# Altium schematic sheet BTL-Sch.SchDoc
size A3; SheetNumber: 1; SheetTotal: 2
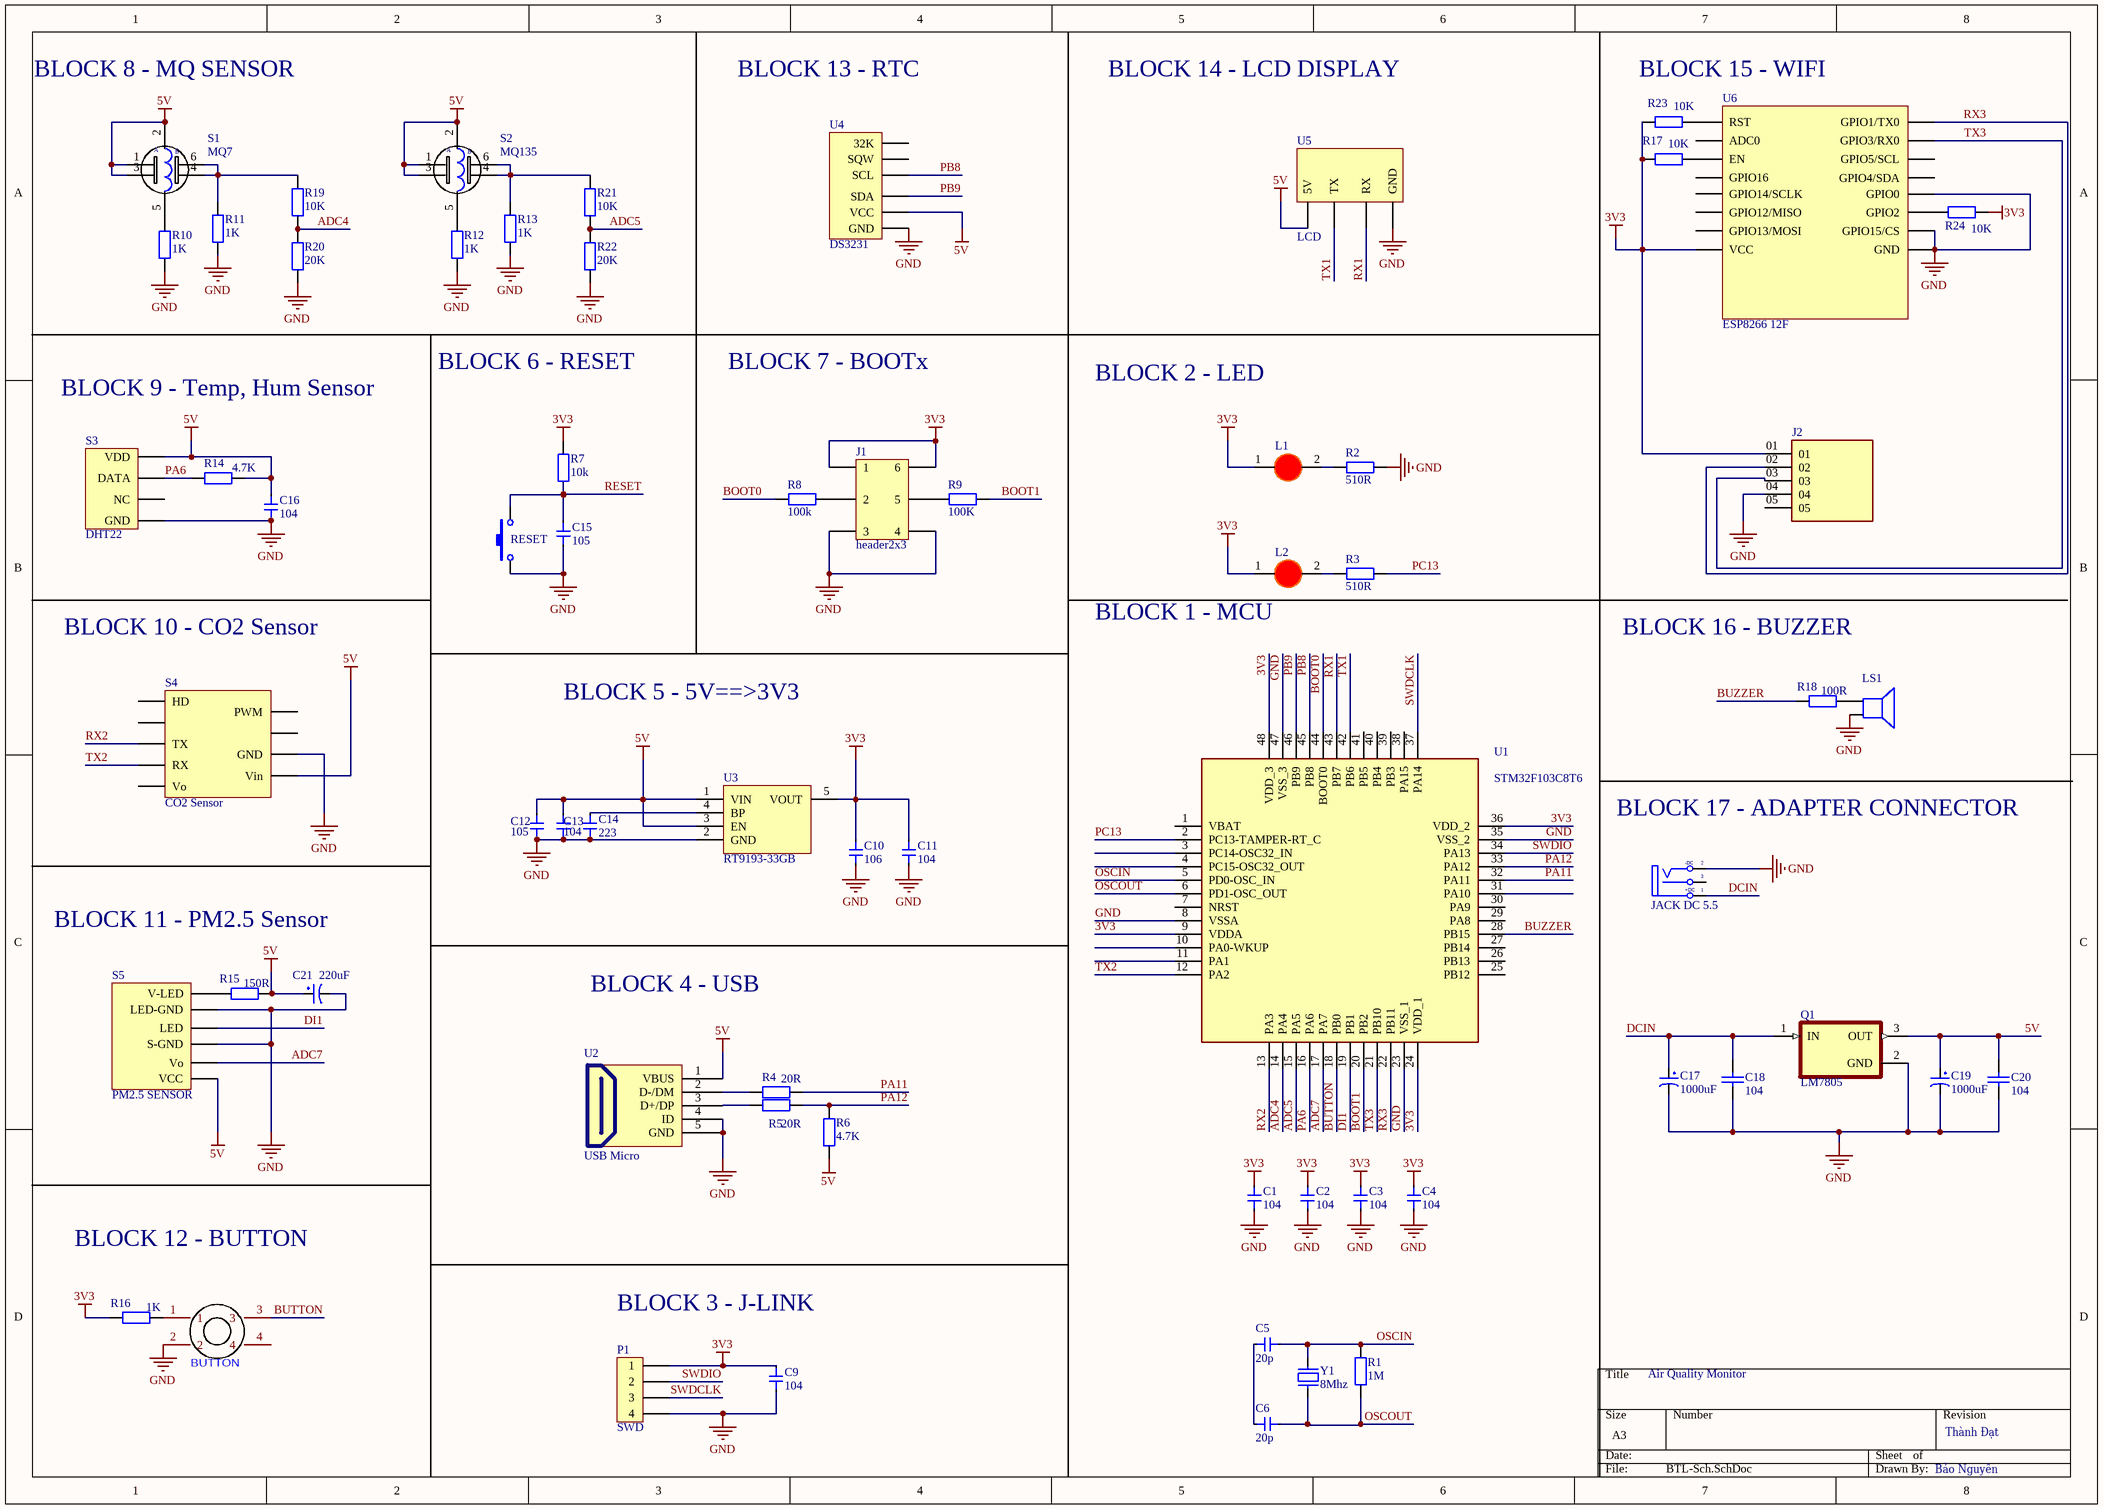
[diagram p0: BTL-Sch.SchDoc]

## Parts
BUTTON  Nut Nhan 4 chan 12x12  [12X12 BUTTOM Blue]  (value not drawn)
C1  104  [Cap 0603]
C2  104  [Cap 0603]
C3  104  [Cap 0603]
C4  104  [Cap 0603]
C5  20p  [Cap 0603]
C6  20p  [Cap 0603]
C9  104  [Cap 0603]
C10  106  [Cap 0805]
C11  104  [Cap 0805]
C12  105  [Cap 0805]
C13  104  [Cap 0603]
C14  223  [Cap 0603]
C15  105  [Cap 0603]
C16  104  [Cap 0603]
C17  1000uF  [tu hoa 8mm]
C18  104  [tu gom]
C19  1000uF  [tu hoa 8mm]
C20  104  [tu gom]
C21  220uF  [tu hoa 5mm]
J1  header2x3  [header2x3]
J2  MTSW-105-24-G-S-255  [SAMTEC_MTSW-105-24-G-S-255]  (value not drawn)
JACK_DC  JACK DC 5.5  [JACK DC 5.5]
L1  LED 0805  [LED-0805-Red]  (value not drawn)
L2  LED 0805  [LED-0805-Red]  (value not drawn)
LS1  Coi Chip Speaker  [Coi Chip Speacker]  (value not drawn)
P1  SWD  [header4p_90]
Q1  LM7805  [TO254P1054X470X2600-3]
R1  1M  [tro smd 0603]
R2  510R  [tro smd 0603]
R3  510R  [tro smd 0603]
R4  20R  [tro smd 0603]
R5  20R  [tro smd 0603]
R6  4.7K  [tro smd 0603]
R7  10k  [tro smd 0603]
R8  100k  [tro smd 0603]
R9  100K  [tro smd 0603]
R10  1K  [tro smd 0603]
R11  1K  [tro smd 0603]
R12  1K  [tro smd 0603]
R13  1K  [tro smd 0603]
R14  4.7K  [tro smd 0603]
R15  150R  [tro smd 0603]
R16  1K  [tro smd 0603]
R17  10K  [tro smd 0603]
R18  100R  [tro smd 0603]
R19  10K  [tro smd 0603]
R20  20K  [tro smd 0603]
R21  10K  [tro smd 0603]
R22  20K  [tro smd 0603]
R23  10K  [tro smd 0603]
R24  10K  [tro smd 0603]
RESET  Nut Nhan 2 Chan SMD 3x6x2.5  [Nut Nhan 2 Chan SMD 3x6x2.5]  (value not drawn)
S1  MQ7  [mq7]
S2  MQ135  [mq135]
S3  DHT22  [dht22]
S4  CO2 Sensor  [co2sensor]
S5  PM2.5 SENSOR  [pm25sensor]
U1  STM32F103C8T6  [LQFP-48_19.6_393_58X11_SMD]
U2  USB Micro  [USB Micro 5p SMD]
U3  RT9193-33GB  [SOT23-5]
U4  DS3231  [DS3231]
U5  LCD  [LCD]
U6  ESP8266 12F  [ESP826612F]
Y1  8Mhz  [Thach Anh 2 chan SMD]

## Nets
3V3: C1.1 C2.1 C3.1 C4.1 C9.1 C10.1 C11.1 J1.1 J1.6 J2.01 L1.1(A) L2.1(A) P1.1 R7.1 R16.1 R17.1 R23.1 R24.2 U1.9(VDDA) U1.24(VDD_1) U1.36(VDD_2) U1.48(VDD_3) U3.5(VOUT) U6.8(VCC)
5V: C12.1 C13.1 C16.1 C19.1 C20.1 C21.1 Q1.3(OUT) R6.1 R14.2 R15.2 S1.1 S1.2 S1.3 S2.1 S2.2 S2.3 S3.1(VDD) S4.9(Vin) S5.6(VCC) U2.1(VBUS) U3.1(VIN) U3.3(EN) U4.5(VCC) U5.1(5V)
GND: BUTTON.2 C1.2 C2.2 C3.2 C4.2 C9.2 C10.2 C11.2 C12.2 C13.2 C14.2 C15.2 C16.2 C17.2 C18.2 C19.2 C20.2 C21.2 J1.3 J1.4 J2.04 JACK_DC.2(TN) LS1.2 P1.4 Q1.2(GND) R2.2 R10.1 R11.2 R12.1 R13.2 R20.1 R22.1 RESET.1 S3.4(GND) S4.8(GND) S5.2(LED-GND) S5.4(S-GND) U1.8(VSSA) U1.23(VSS_1) U1.35(VSS_2) U1.47(VSS_3) U2.4(ID) U2.5(GND) U3.2(GND) U4.6(GND) U5.4(GND) U6.15(GND) U6.16(GPIO15/CS) U6.18(GPIO0)
ADC4: R19.1 R20.2 U1.14(PA4)
ADC5: R21.1 R22.2 U1.15(PA5)
ADC7: S5.5(Vo) U1.17(PA7)
BOOT0: R8.2 U1.44(BOOT0)
BOOT1: R9.1 U1.20(PB2)
BUTTON: BUTTON.3 U1.18(PB0)
BUZZER: R18.1 U1.28(PB15)
DCIN: C17.1 C18.1 JACK_DC.1(T) Q1.1(IN)
DI1: S5.3(LED) U1.19(PB1)
OSCIN: C5.2 R1.2 U1.5(PD0-OSC_IN) Y1.2
OSCOUT: C6.2 R1.1 U1.6(PD1-OSC_OUT) Y1.1
PA6: R14.1 S3.2(DATA) U1.16(PA6)
PA11: R4.1 U1.32(PA11)
PA12: R5.1 R6.2 U1.33(PA12)
PB8: U1.45(PB8) U4.3(SCL)
PB9: U1.46(PB9) U4.4(SDA)
PC13: R3.2 U1.2(PC13-TAMPER-RT_C)
RESET: C15.1 R7.2 RESET.2
RX1: U1.43(PB7) U5.3(RX)
RX2: S4.3(TX) U1.13(PA3)
RX3: J2.02 U1.22(PB11) U6.22(GPIO1/TX0)
SWDCLK: P1.3 U1.37(PA14)
SWDIO: P1.2 U1.34(PA13)
TX1: U1.42(PB6) U5.2(TX)
TX2: S4.4(RX) U1.12(PA2)
TX3: J2.03 U1.21(PB10) U6.21(GPIO3/RX0)
NetBUTTON_1: BUTTON.1 R16.2
NetC5_1: C5.1 C6.1
NetC14_1: C14.1 U3.4(BP)
NetJ1_2: J1.2 R8.1
NetJ1_5: J1.5 R9.2
NetL1_2: L1.2(K) R2.1
NetL2_2: L2.2(K) R3.1
NetLS1_1: LS1.1 R18.2
NetR4_2: R4.2 U2.2(D-/DM)
NetR5_2: R5.2 U2.3(D+/DP)
NetR10_2: R10.2 S1.5
NetR11_1: R11.1 R19.2 S1.4 S1.6
NetR12_2: R12.2 S2.5
NetR13_1: R13.1 R21.2 S2.4 S2.6
NetR15_1: R15.1 S5.1(V-LED)
NetR17_2: R17.2 U6.3(EN)
NetR23_2: R23.2 U6.1(RST)
NetR24_1: R24.1 U6.17(GPIO2)

Not connected (* = marked no-connect by the designer): BUTTON 4; J2 05; JACK_DC 3(S); S3 3(NC); S4 1(HD) 2 5(Vo) 6(PWM) 7; U1 1(VBAT) 3(PC14-OSC32_IN) 4(PC15-OSC32_OUT) 7(NRST) 10(PA0-WKUP) 11(PA1) 25(PB12) 26(PB13) 27(PB14) 29(PA8) 30(PA9) 31(PA10) 38(PA15) 39(PB3) 40(PB4) 41(PB5); U4 1(32K) 2(SQW); U6 2(ADC0) 4(GPIO16) 6(GPIO12/MISO) 7(GPIO13/MOSI) 19(GPIO4/SDA) 20(GPIO5/SCL)

## Notes on the sheet
- BLOCK 8 - MQ SENSOR
- BLOCK 13 - RTC
- BLOCK 14 - LCD DISPLAY
- BLOCK 15 - WIFI
- BLOCK 9 - Temp, Hum Sensor
- BLOCK 6 - RESET
- BLOCK 7 - BOOTx
- BLOCK 2 - LED
- BLOCK 10 - CO2 Sensor
- (near L2) BLOCK 1 - MCU
- BLOCK 16 - BUZZER
- BLOCK 5 - 5V==>3V3
- (near JACK_DC) BLOCK 17 - ADAPTER CONNECTOR
- BLOCK 11 - PM2.5 Sensor
- BLOCK 4 - USB
- BLOCK 12 - BUTTON
- BLOCK 3 - J-LINK
- Air Quality Monitor
- Thành Đạt
- Bảo Nguyên
- (in symbol JACK DC 5.5) -DC; +DC
- (in symbol MQ7) A; B
- (in symbol MQ135) A; B

## Library data of the parts
C1-C6 C9 C13-C16 = Cap 0603: Capacitor SMD 0603
C10-C12 = Cap 0805: Capacitor SMD 0805
C17 C19 = Tu Hoa 1000uF 16V 8x20: Cắm; Don_Vi: Con; So_Chan: 2; Ten_Linh_Kien: Tụ Hóa 1000uF 16V 8x20MM; Ma_Hang: MH008300; Chung_Loai: Cắm; Kieu_Chan: *
C18 C20 = Tu gom 104 50V: Cắm; So_Chan: 2; Ten_Linh_Kien: Tụ gốm 104 100nF 50V; Don_Vi: Con; Ma_Hang: MH004761; Chung_Loai: Cắm; Kieu_Chan: *
C21 = Tu Hoa 220uF 10V 6x11: Cắm; Don_Vi: Con; So_Chan: 2; Ten_Linh_Kien: Tụ Hóa 220uF 10V 6x11MM; Ma_Hang: MH004510; Chung_Loai: Cắm; Kieu_Chan: *
JACK_DC = JACK DC 5.5: Value: Jac DC
L1 L2 = LED 0805 Do: Dán; Don_Vi: Con; Ma_Hang: MH000897; Ten_Linh_Kien: LED 0805 Màu Đỏ (Red); Ghi_Chu: *; Kieu_Chan: *; Chung_Loai: Dán
LS1 = Coi Chip Speaker: Còi chip
P1 = header4p_90
Q1 = LM7805: IC Regulator 7805T/LM7805T COMSET RoHS TO220; MP: LM7805CT; MF: Comset Semiconductors; Price: None; Availability: Not in stock; Package: TO-220 Comset Semiconductors; SnapEDA_Link: https://www.snapeda.com/parts/LM7805CT/Comset+Semiconductors/view-part/?ref=snap; Check_prices: https://www.snapeda.com/parts/LM7805CT/Comset+Semiconductors/view-part/?ref=eda; Value: *
R1 R4-R6 = Tro 0603 1% 1k: Dán; So_Chan: 2; Don_Vi: Con; Ten_Linh_Kien: Trở 0603 1% 1k; Ma_Hang: MH006334; Chung_Loai: Dán; Kieu_Chan: *
R2 R3 R7-R24 = Tro 0603 1% 10k: Dán; Don_Vi: Con; So_Chan: 2; Ten_Linh_Kien: Trở 0603 1% 10k; Ma_Hang: MH006333; Chung_Loai: Dán; Kieu_Chan: *
RESET = Nut Nhan 2 Chan SMD 3x6x2.5: Ma_Hang: MH001036; Ten: Nút Nhấn 2 Chân 3x6x2.5MM SMD
U1 = IC_STM32F103C8T6: ARM® Cortex®-M3 STM32F1 Microcontroller IC 32-Bit 72MHz 64KB (64K x 8) FLASH 48-LQFP (7x7); Manufacturer: STMicroelectronics; Alternate Part Number-1: NA; Manufacturer Part Number: STM32F103C8T6; Case/Package: LQFP48; Supplier-1: LCSC; Supplier Part Number-1: STM32F103C8T6
U2 = USB Micro 5p SMD: USB Type B; Ten: MicroUSB MK5P SMD; Ma_Hang: MH001020
U3 = REG_5.5V-3.3V-0.3A-1W-SOT-23-5: Linear Voltage Regulator IC 1 Output 300mA SOT-23-5; Manufacturer: Richtek USA Inc.; Alternate Part Number-1: NA; Manufacturer Part Number: RT9193-33GB; Supplier-1: LCSC; Supplier Part Number-1: C15651; Case/Package: SOT-23-5
Y1 = Thach Anh 2 chan SMD: Crystal For all Crystal 2pin.; Value: 4Mhz
J2 = MTSW-105-24-G-S-255: Package: None; MP: MTSW-105-24-G-S-255; Price: None; Value: *; Availability: Unavailable